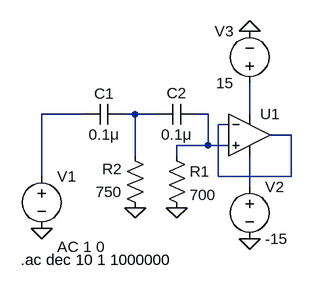
[diagram p0: schematic Lab7HP.asc]
Lab7HP.asc, the LTspice schematic file:
Version 4
SHEET 1 880 680
WIRE 32 80 -32 80
WIRE 112 80 96 80
WIRE 144 80 112 80
WIRE 224 80 208 80
WIRE 288 80 288 32
WIRE 256 96 240 96
WIRE 352 112 320 112
WIRE 224 128 224 80
WIRE 224 128 176 128
WIRE 256 128 224 128
WIRE 112 144 112 80
WIRE 176 144 176 128
WIRE -32 176 -32 80
WIRE 240 176 240 96
WIRE 352 176 352 112
WIRE 352 176 240 176
WIRE 288 192 288 144
FLAG -32 256 0
FLAG 176 224 0
FLAG 288 272 0
FLAG 288 -48 0
FLAG 112 224 0
SYMBOL cap 96 64 R90
WINDOW 0 0 32 VBottom 2
WINDOW 3 32 32 VTop 2
SYMATTR InstName C1
SYMATTR Value 0.1μ
SYMBOL cap 208 64 R90
WINDOW 0 -1 32 VBottom 2
WINDOW 3 32 32 VTop 2
SYMATTR InstName C2
SYMATTR Value 0.1μ
SYMBOL voltage -32 160 R0
WINDOW 123 24 124 Left 2
WINDOW 39 0 0 Left 0
SYMATTR Value2 AC 1 0
SYMATTR InstName V1
SYMATTR Value ""
SYMBOL voltage 288 176 R0
WINDOW 123 0 0 Left 0
WINDOW 39 0 0 Left 0
SYMATTR InstName V2
SYMATTR Value -15
SYMBOL voltage 288 48 R180
WINDOW 0 24 96 Left 2
WINDOW 3 24 16 Left 2
WINDOW 123 0 0 Left 0
WINDOW 39 0 0 Left 0
SYMATTR InstName V3
SYMATTR Value 15
SYMBOL OpAmps\\UniversalOpAmp 288 112 R0
SYMATTR InstName U1
SYMBOL res 160 128 R0
SYMATTR InstName R1
SYMATTR Value 700
SYMBOL res 128 240 R180
WINDOW 0 36 76 Left 2
WINDOW 3 36 40 Left 2
SYMATTR InstName R2
SYMATTR Value 750
TEXT -64 304 Left 2 !.ac dec 10 1 1000000

The netlist it stands for:
* Lab7HP.asc
C1 N002 N001 0.1μ
C2 N003 N002 0.1μ
V1 N001 0 AC 1 0
V2 N006 0 -15
V3 N004 0 15
XU1 N003 N005 N004 N006 N005 level1 Avol=1Meg GBW=10Meg Vos=0 En=0 Enk=0 In=0 Ink=0 Rin=500Meg  ; pins In+ In- V+ V- OUT
R1 N003 0 700
R2 0 N002 750
.ac dec 10 1 1000000
.lib UniversalOpAmp1.lib
.backanno
.end